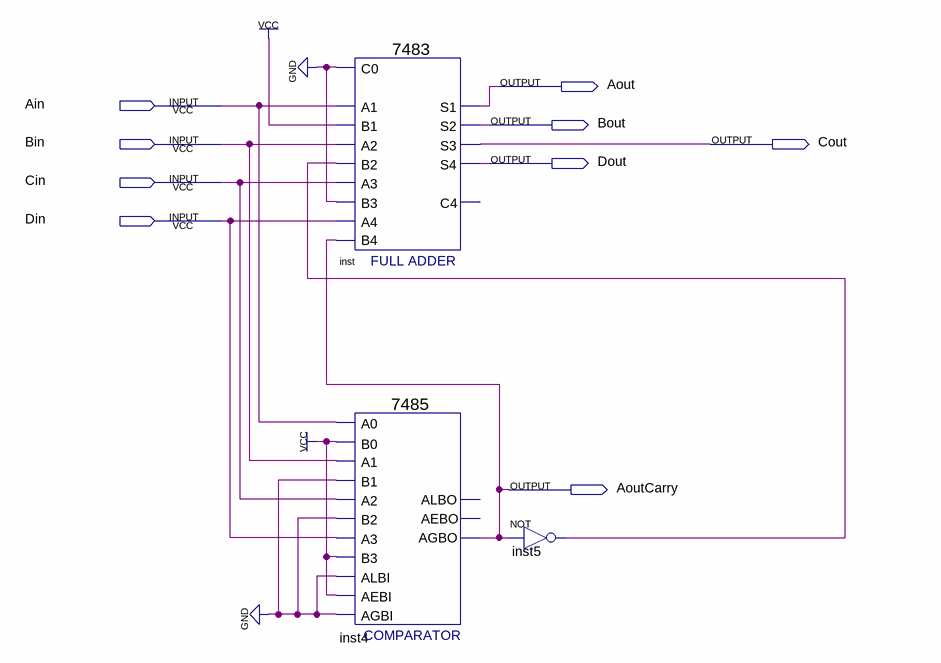
[diagram p0: schematic sheet]
// Quartus schematic Lab11.bdf as structural Verilog: 3 symbols, 9 pins
module Lab11 (
  input  Ain,
  input  Bin,
  input  Cin,
  input  Din,
  output Aout,
  output Bout,
  output Cout,
  output Dout,
  output AoutCarry
);

  wire inst5_out;

  \7483  inst (
    .B4(AoutCarry), .C0(1'b0), .A1(Ain), .A2(Bin), .B1(1'b1), .B2(inst5_out), .A3(Cin), .B3(1'b0), .A4(Din),
    .S3(Cout), .S4(Dout), .S2(Bout), .S1(Aout));  // open: C4
  \7485  inst4 (
    .A3(Din), .B2(1'b0), .A2(Cin), .AEBI(1'b1), .AGBI(1'b0), .ALBI(1'b0), .A0(Ain), .B0(1'b1), .B3(1'b1),
    .A1(Bin), .B1(1'b0), .AGBO(AoutCarry));  // open: ALBO, AEBO
  not inst5 (inst5_out, AoutCarry);
endmodule
